# EAGLE design ArduProMini_chibi (EAGLE 6.2)
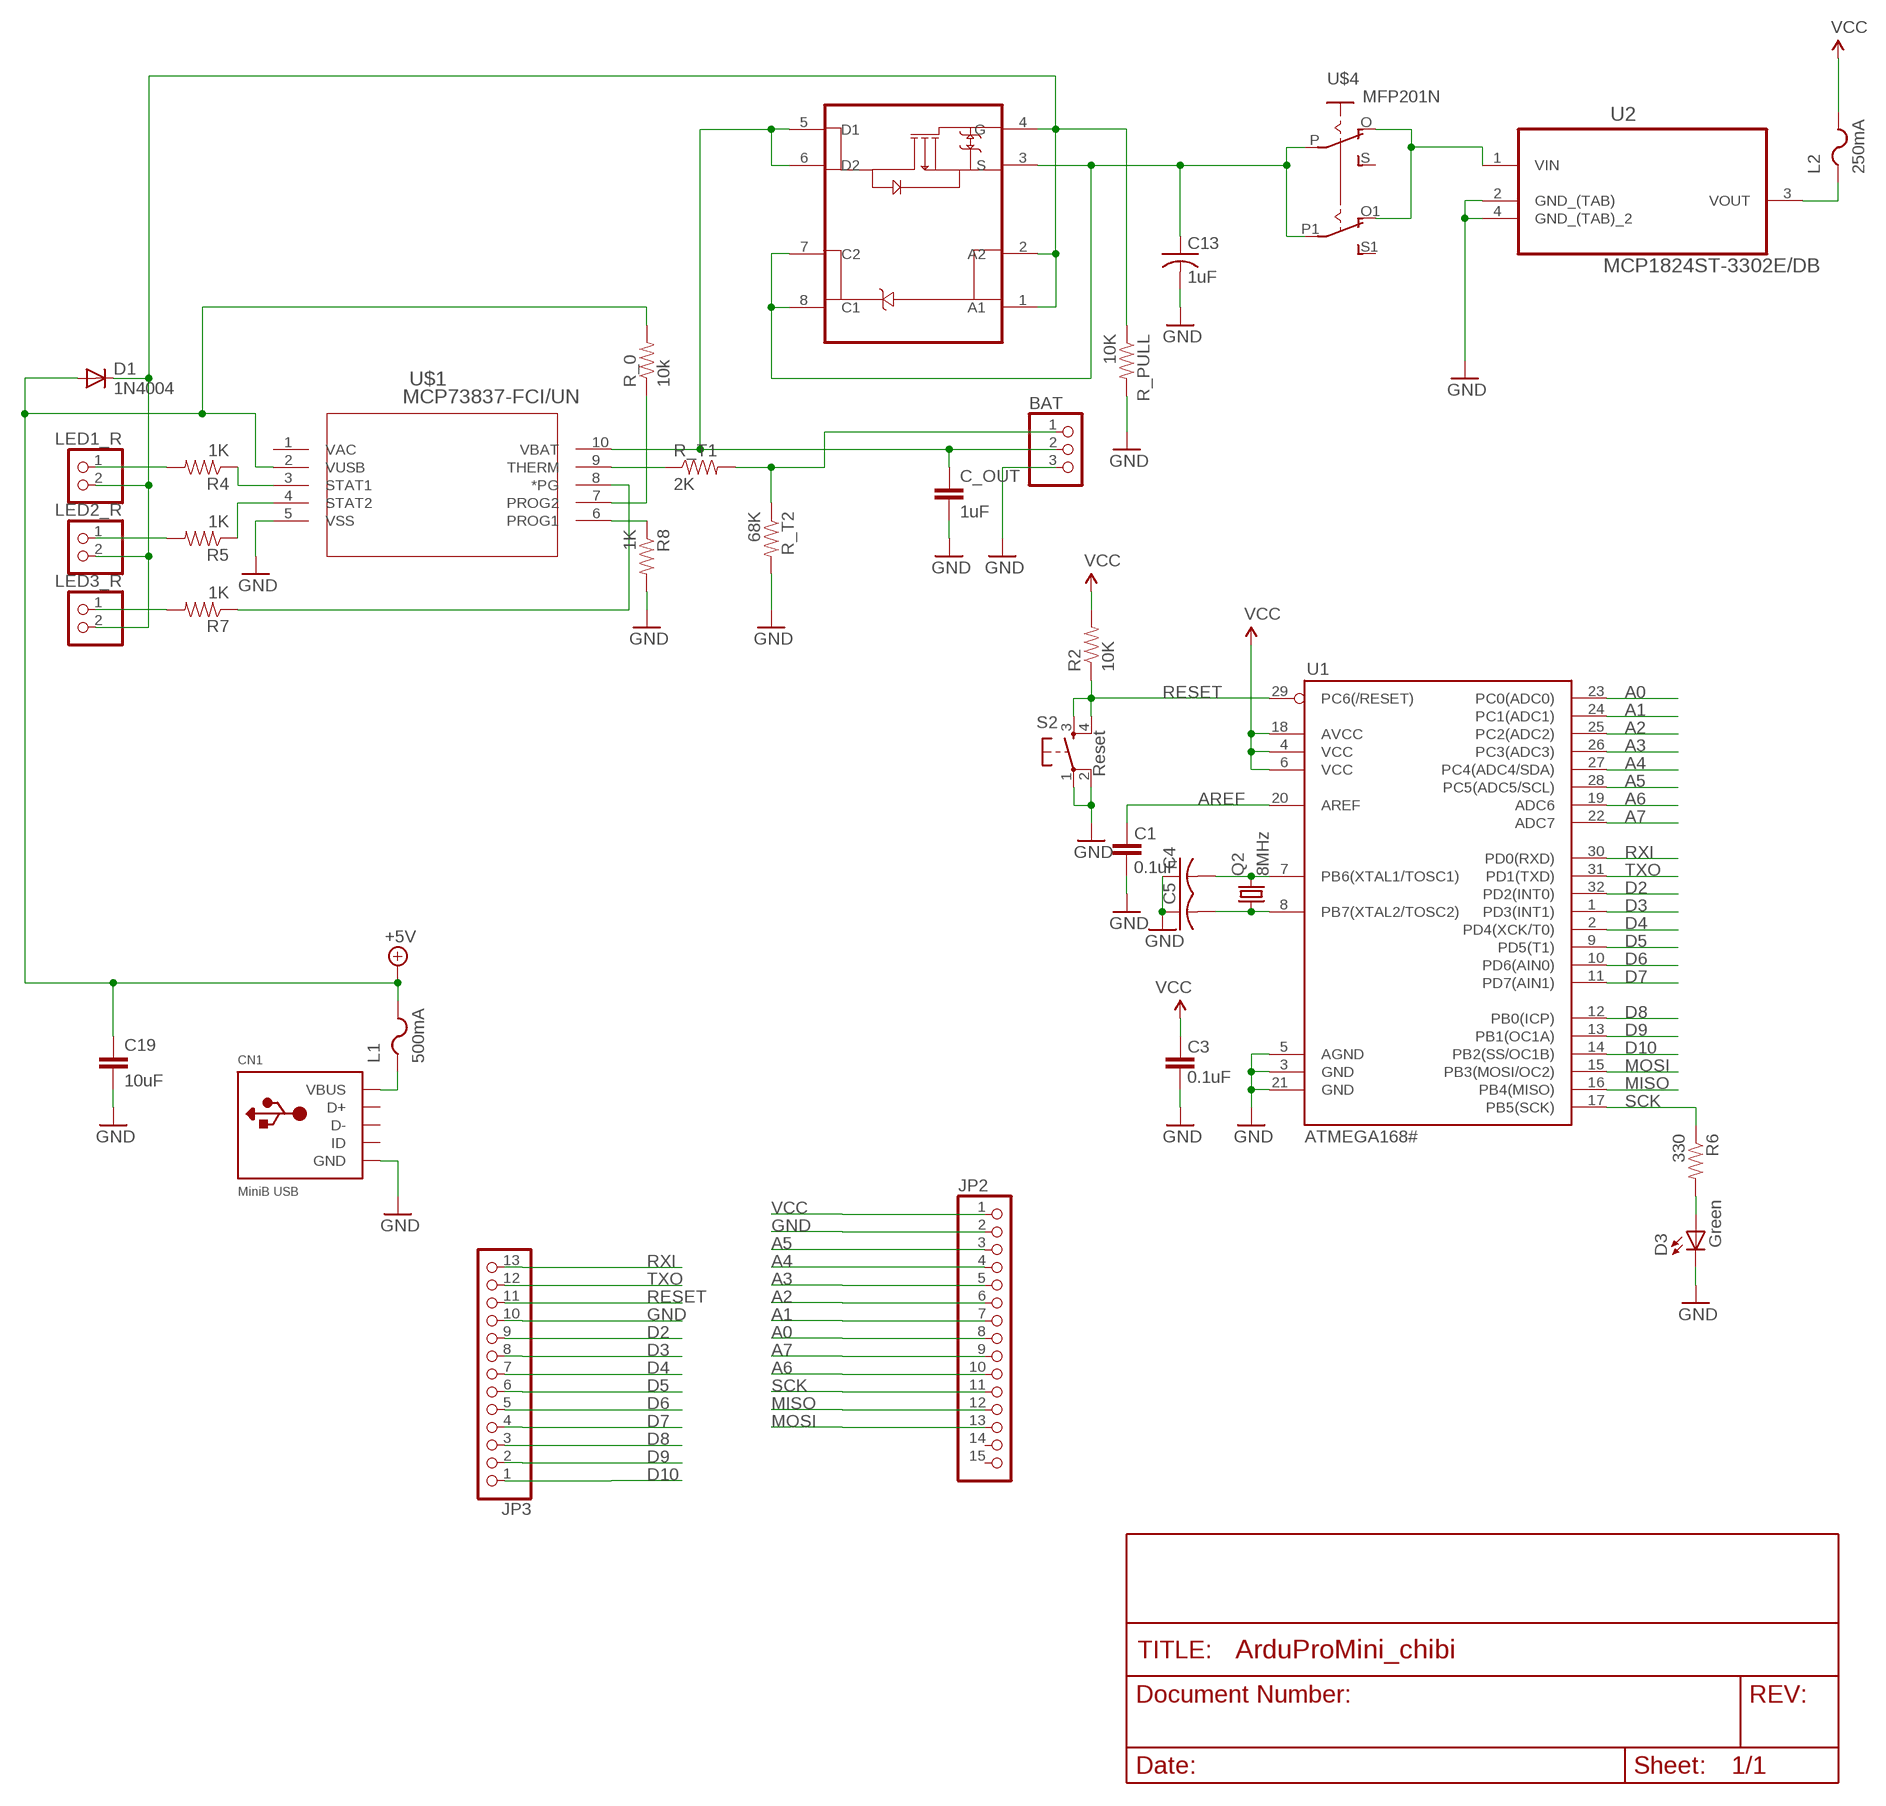
[diagram p0: schematic, sheet 1, part 1 of 2]
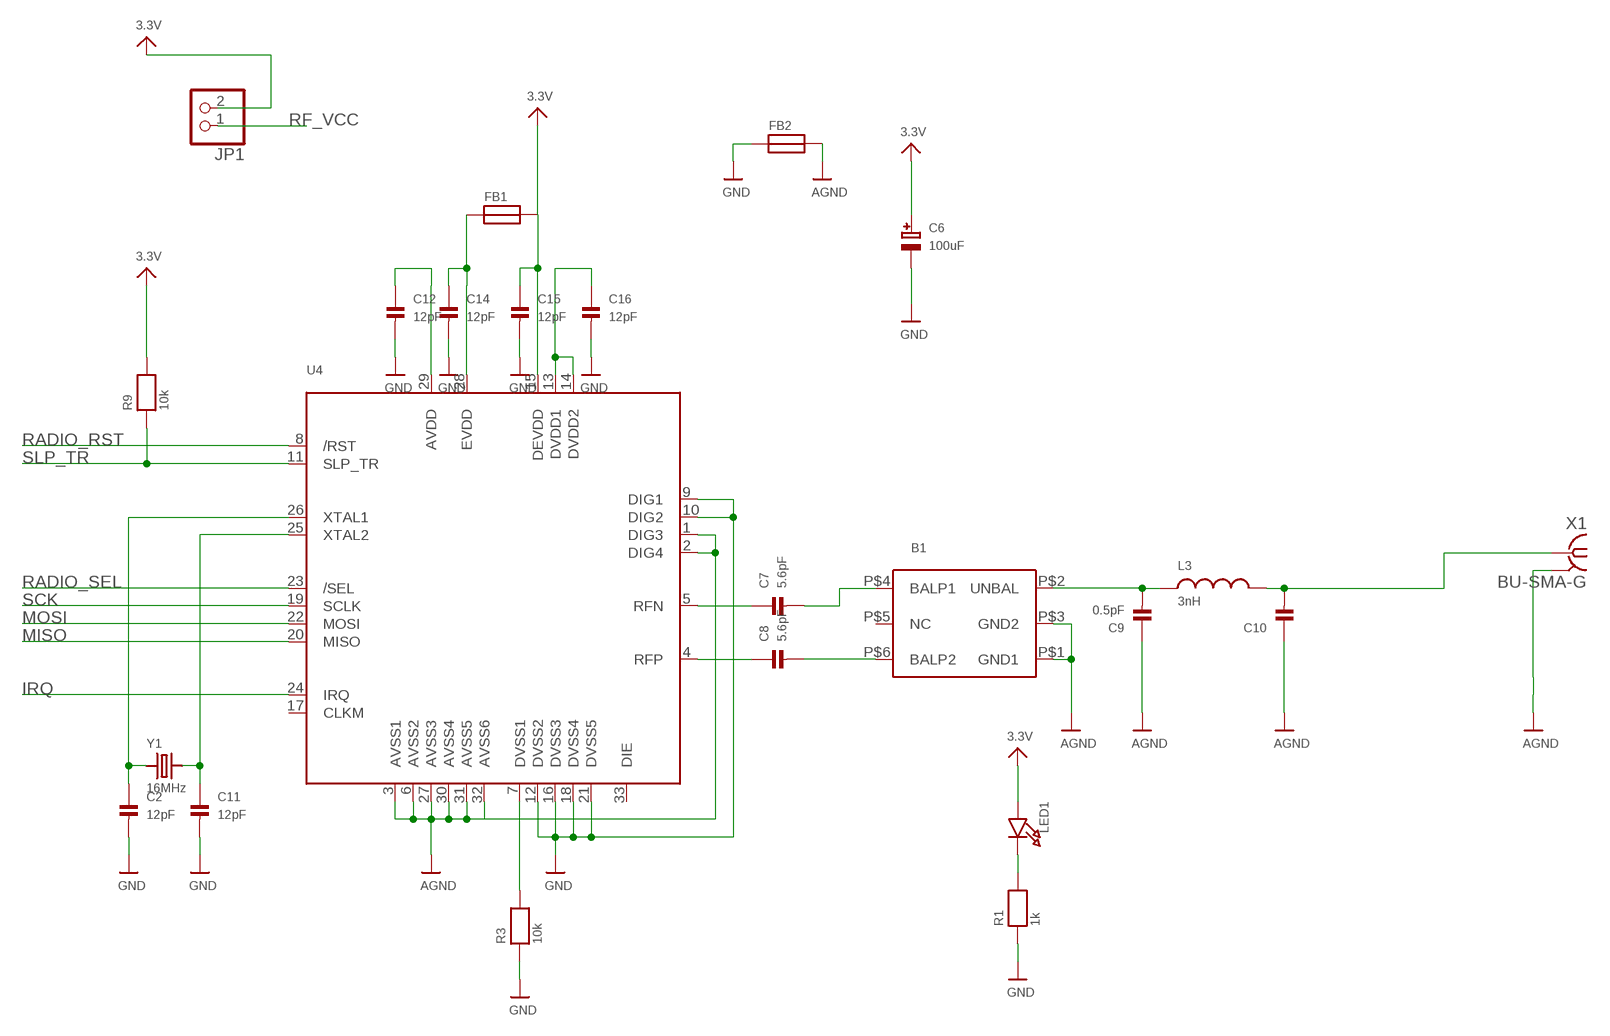
[diagram p1: schematic, sheet 1, part 2 of 2]

## Parts
B1  BALUN  [BALUN1206]
BAT  PINHD-1X3  [1X03]
C1  0.1uF  CAP0805  [0805]
C2  12pF  CAP_CERAMIC0805  [0805]
C3  0.1uF  CAP0805  [0805]
C4  C-USC0805  [C0805]
C5  C-USC0805  [C0805]
C6  100uF  CAP_ELECTROLYTICPANASONIC_C  [PANASONIC_C]
C7  5.6pF  CAP_CERAMIC0805  [0805]
C8  5.6pF  CAP_CERAMIC0805  [0805]
C9  0.5pF  CAP_CERAMIC0805  [0805]
C10  CAP_CERAMIC0805  [0805]
C11  12pF  CAP_CERAMIC0805  [0805]
C12  12pF  CAP_CERAMIC0805  [0805]
C13  1uF  C-USC0805  [C0805]
C14  12pF  CAP_CERAMIC0805  [0805]
C15  12pF  CAP_CERAMIC0805  [0805]
C16  12pF  CAP_CERAMIC0805  [0805]
C19  10uF  C-EUC1206  [C1206]
C_OUT  1uF  CAP0805  [0805]
CN1  MiniB USB  USBMINIB  [USB-MINIB]
D1  1N4004  [DO41-10]
D3  Green  LED0603  [LED-0603]
FB1  FERRITE  [0603]
FB2  FERRITE  [0603]
JP1  PINHD-1X2  [1X02]
JP2  PINHD-1X15  [1X15]
JP3  PINHD-1X13  [1X13]
L1  500mA  PTCFUSE-1206  [R1206]
L2  250mA  PTCFUSE-1206  [R1206]
L3  3nH  INDUCTOR0805  [0805]
LED1  LED0805  [CHIPLED_0805]
LED1_R  PINHD-1X2  [1X02]
LED2_R  PINHD-1X2  [1X02]
LED3_R  PINHD-1X2  [1X02]
Q2  8MHz  CRYSTALCTS406  [CTS406]
R1  1k  RESISTOR0805  [0805]
R2  10K  RESISTOR  [0805]
R3  10k  RESISTOR0805  [0805]
R4  1K  RESISTOR  [0805]
R5  1K  RESISTOR  [0805]
R6  330  RESISTOR  [0805]
R7  1K  RESISTOR  [0805]
R8  1K  RESISTOR  [0805]
R9  10k  RESISTOR0805  [0805]
R_0  10k  RESISTOR  [0805]
R_PULL  10K  RESISTOR  [0805]
R_T1  2K  RESISTOR  [0805]
R_T2  68K  RESISTOR  [0805]
S2  Reset  TAC_SWITCHSMD  [TACTILE_SWITCH_SMD]
U1  ATMEGA168#  ATMEGA168  [TQFP32-08]
U2  MCP1824ST-3302E/DB  [SOT230P700X180-4N]
U4  AT86RF212  [32QN2]
U$1  MCP73837-FCI/UN  [SOP50P490X110-8N]
U$3  FDFS2P753Z  [SOIC127P600X175-8N]
U$4  MFP201N  [MFP201N]
X1  BU-SMA-G  [BU-SMA-G]
Y1  16MHz  CRYSTALSMD  [HC49UP]

## Nets
+5V: C19.1 D1.A L1.2 R_0.2 U$1.2(VUSB)
A0: JP2.8 U1.23(PC0(ADC0))
A1: JP2.7 U1.24(PC1(ADC1))
A2: JP2.6 U1.25(PC2(ADC2))
A3: JP2.5 U1.26(PC3(ADC3))
A4: JP2.4 U1.27(PC4(ADC4/SDA))
A5: JP2.3 U1.28(PC5(ADC5/SCL))
A6: JP2.10 U1.19(ADC6)
A7: JP2.9 U1.22(ADC7)
AGND: B1.P$1(GND1) B1.P$3(GND2) C9.1 C10.1 FB2.2 U4.1(DIG3) U4.2(DIG4) U4.3(AVSS1) U4.6(AVSS2) U4.27(AVSS3) U4.30(AVSS4) U4.31(AVSS5) U4.32(AVSS6) X1.2(GND)
AREF: C1.2 U1.20(AREF)
D2: JP3.9 U1.32(PD2(INT0))
D3: JP3.8 U1.1(PD3(INT1))
D4: JP3.7 U1.2(PD4(XCK/T0))
D5: JP3.6 U1.9(PD5(T1))
D6: JP3.5 U1.10(PD6(AIN0))
D7: JP3.4 U1.11(PD7(AIN1))
D8: JP3.3 U1.12(PB0(ICP))
D9: JP3.2 U1.13(PB1(OC1A))
D10: JP3.1 U1.14(PB2(SS/OC1B))
GND: BAT.3 C1.1 C2.2 C3.1 C4.1 C5.1 C6.- C11.2 C12.2 C13.2 C14.2 C15.2 C16.2 C19.2 C_OUT.2 CN1.GND D3.C FB2.1 JP2.2 JP3.10 R1.1 R3.1 R8.2 R_PULL.2 R_T2.2 S2.1 S2.2 U1.3(GND) U1.5(AGND) U1.21(GND) U2.2(GND_(TAB)) U2.4(GND_(TAB)_2) U4.9(DIG1) U4.10(DIG2) U4.12(DVSS2) U4.16(DVSS3) U4.18(DVSS4) U4.21(DVSS5) U$1.5(VSS)
IRQ: U4.24(IRQ)
MISO: JP2.12 U1.16(PB4(MISO)) U4.20(MISO)
MOSI: JP2.13 U1.15(PB3(MOSI/OC2)) U4.22(MOSI)
N$1: C5.2 Q2.1 U1.8(PB7(XTAL2/TOSC2))
N$2: U2.1(VIN) U$4.O U$4.O1
N$3: C4.2 Q2.3 U1.7(PB6(XTAL1/TOSC1))
N$4: R_T1.1 U$1.9(THERM)
N$5: R7.1 U$1.8(*PG)
N$6: C13.1 U$3.3(S) U$3.7(C2) U$3.8(C1) U$4.P U$4.P1
N$7: D3.A R6.2
N$8: LED3_R.1 R7.2
N$9: BAT.2 C_OUT.1 U$1.10(VBAT) U$3.5(D1) U$3.6(D2)
N$10: L2.1 U2.3(VOUT)
N$11: D1.C LED1_R.2 LED2_R.2 LED3_R.2 R_PULL.1 U$3.1(A1) U$3.2(A2) U$3.4(G)
N$12: LED2_R.1 R5.2
N$13: LED1_R.1 R4.2
N$14: R5.1 U$1.4(STAT2)
N$15: R4.1 U$1.3(STAT1)
N$16: BAT.1 R_T1.2 R_T2.1
N$17: C7.1 U4.5(RFN)
N$18: R8.1 U$1.6(PROG1)
N$19: R_0.1 U$1.7(PROG2)
N$20: C8.1 U4.4(RFP)
N$21: B1.P$4(BALP1) C7.2
N$22: B1.P$6(BALP2) C8.2
N$23: B1.P$2(UNBAL) C9.2 L3.1
N$24: C10.2 L3.2 X1.1
N$25: LED1.C R1.2
N$26: C2.1 U4.26(XTAL1) Y1.1
N$27: C11.1 U4.25(XTAL2) Y1.2
N$28: R3.2 U4.7(DVSS1)
N$29: C16.1 U4.13(DVDD1) U4.14(DVDD2)
N$30: C14.1 FB1.1 U4.28(EVDD)
N$31: C12.1 U4.29(AVDD)
RADIO_RST: U4.8(/RST)
RADIO_SEL: U4.23(/SEL)
RESET: JP3.11 R2.1 S2.3 S2.4 U1.29(PC6(/RESET))
RF_VCC: C6.+ C15.1 FB1.2 JP1.1 LED1.A R9.2 U4.15(DEVDD) ; supply symbol labelled 3.3V
RXI: JP3.13 U1.30(PD0(RXD))
SCK: JP2.11 R6.1 U1.17(PB5(SCK)) U4.19(SCLK)
SLP_TR: R9.1 U4.11(SLP_TR)
TXO: JP3.12 U1.31(PD1(TXD))
VBUS: CN1.VBUS L1.1
VCC: C3.2 JP1.2 JP2.1 L2.2 R2.2 U1.4(VCC) U1.6(VCC) U1.18(AVCC) ; supply symbol labelled 3.3V
Unconnected: B1.P$5(NC) CN1.D+ CN1.D- CN1.ID JP2.14 JP2.15 U4.17(CLKM) U4.33(DIE) U$1.1(VAC) U$4.S U$4.S1

## Power pins joined to a net without a drawn wire
GND: X1.3(GND) X1.4(GND) X1.5(GND)

## Library data of the parts
B1 = microbuilder:BALUN: BALUN - Baluns for RF 1206 800-1000MHz Balun (1206) - Digikey: 712-1023-1-ND
BAT = pinhead:PINHD-1X3: PIN HEADER
C1 C3 C_OUT = SparkFun:CAP: Capacitor Standard 0603 ceramic capacitor, and 0.1" leaded capacitor.
C2 C7-C12 C14-C16 = microbuilder:CAP_CERAMIC: Ceramic Capacitors 0402 - 0402 Surface Mount Capacitors 16pF 50V 5% [Digikey: 445-4899-2-ND] 18pF 50V 5% [Digikey: 490-1281-2-ND] 22pF 50V 5% [Digikey: 490-1283-2-ND] 68pF 50V 5% [Digikey: 490-1289-2-ND] 0.1uF 10V 10% [Digikey: 490-1318-2-ND] 1.0uF 6.3V 10% [Digikey: 490-1320-2-ND] 0603 - 0603 Surface Mount Capacitors 16 pF 50V 5% [Digikey: 445-5051-2-ND] 22 pF 50V [Digikey: PCC220ACVTR-ND] 33 pF 50V 5% [Digikey: 490-1415-1-ND] 56pF 50V 5% [Digikey: 490-1421-1-ND] 220pF 50V 5% [Digikey: 445-1285-1-ND] 680 pF 50V 2200 pF 50V 5% C0G [Digikey: 445-1297-1-ND] 5600 pF 100V 5% X7R [Digikey: 478-3711-1-ND] 0.1 µF 25V 10% [Digikey: PCC2277TR-ND] 0.22 µF 16V 10% X7R [Digikey: 445-1318-1-ND] 1.0 µF 25V 10% [Digikey: 445-5146-2-ND] 0603 - RF Specific 3pF 250V +/-0.1pF RF [Digikey: 712-1347-1-ND] 18 pF 250V 5% [Digikey: 478-3505-1-ND or 712-1322-1-ND] 56 pF 250V 5% C0G RF [Digikey: 490-4867-1-ND] 68 pF 250V RF [Digikey: 490-4868-1-ND] 0805 - 0805 Surface Mount Capacitors 220 pF 250V 2% RF Ceramic Capacitor [Digikey: 712-1398-1-ND] 1000 pF 50V 2% NP0 Ceramic Capacitor [Digikey: 478-3760-1-ND] 0.1 µF 25V 10% Ceramic Capacitor [Digikey: PCC1828TR-ND] 1.0 µF 16V 10% Ceramic Capacitor[Digikey: 490-1691-2-ND] 10.0 µF 10V 10% Ceramic Capacitor[Digikey: 709-1228-1-ND] 10.0 uF 16V 10% Ceramic Capacitor [Digikey: 478-5165-2-ND] 47 uF 6.3V 20% Ceramic Capacitor [Digikey: 587-1779-1-ND or 399-5506-1-ND] 1206 - 1206 Surface Mount Capacitors 47uF 10V 20% Ceramic Capacitor [Digikey: 490-5528-1-ND or 399-5508-1-ND or 445-6010-1-ND]
C4 C5 C13 = rcl:C-US: CAPACITOR, American symbol
C6 = microbuilder:CAP_ELECTROLYTIC: Electrolytic Capacitors PANASONIC_C - Size C Panasonic Electrolytic Aluminum Capacitor 47µF 16V 20% Electrolytic Capacitor [Digikey: PCE3890TR-ND] PANASONIC_D - Size D Panasonic Electrolytic Aluminum Capacitor 100µF 25V 20% Electrolytic Capacitor [Digikey: PCE3898TR-ND]
C19 = rcl:C-EU: CAPACITOR, European symbol
CN1 = adafruit:USB: USB Connectors USBMINIB - Surface Mount Female Mini-B USB Connector 4UConnector: 06564 By microbuilder.eu Thru-hole RA Female Mini-B USB Connector 4UConnector: 18732 By ladyada.net
D1 = diode:1N4004: DIODE general purpose rectifier, 1 A
D3 = SparkFun:LED: LEDs Standard schematic elements and footprints for 5mm, 3mm, 1206, and 0603 sized LEDs. 5mm - Spark Fun Electronics SKU : COM-00529 (and others)
FB1 FB2 = microbuilder:FERRITE: Ferrite Bead 0603 MMZ1608B121C - 120 Ohm, 600mA Ferrite Chip - Digikey: 445-2164-1-ND BK1608HW121-T - 120 Ohm, 600mA Ferrite Chip - Digikey: 587-1876-2-ND
JP1 LED1_R LED2_R LED3_R = pinhead:PINHD-1X2: PIN HEADER
JP2 = pinhead:PINHD-1X15: PIN HEADER
JP3 = pinhead:PINHD-1X13: PIN HEADER
L1 L2 = adafruit:PTCFUSE: PTC fuses, resettable thermistors
L3 = microbuilder:INDUCTOR: Inductors 0603: 10nH Ceramic Inductor - microwire antenna/RF (Digikey: 712-1434-2-ND) 0805: 560nH Ceramic Inductor - RF (Digikey: 553-1047-1-ND) 1007 (2518 Metric) SMT: 10µH 10% 250mOhm 820mA 1007 Inductor (Digikey: 587-2189-1-ND) 22µH 10% 500mOhm 580mA 1007 Inductor (Digikey: 587-2190-1-ND) 47µH 10% 950mOhm 420mA 1007 Inductor (Digikey: 587-2191-1-ND) 47µH 5% 100mOhm 1A 1008 Inductor (Digikey: 732-1816-1-ND) 6.0x6.0mm: 4.7µH 20% 3.8A 27mOhm Inductor (Digikey: 445-6538-2-ND)
LED1 = microbuilder:LED: LED 0603 - 0603 Surface Mount Package 2mA: Green LED - Low Power (3.9mcd, 2ma, 1.7Vf) - Digikey: 475-2709-2-ND Orange LED - Low Power (9.8mcd, 2ma, 1.8Vf) - Digikey: 475-1194-2-ND Red LED - Low Power (5mcd, 2ma, 1.8Vf) - Digikey: 475-1195-2-ND Yellow LED - Low Power (7mcd, 2ma, 1.8Vf) - Digikey: 475-1196-2-ND 5mA: Blue LED - Low Power (17mcd, 5ma, 2.9Vf) - Digikey: LNJ937W8CRACT-ND 0805 - 0805 Surface Mount Package 2mA: Red LED (8.8mcd, 2mA, 1.8Vf, Clear) - Low Power [Digikey: 475-2510-1-ND] Green LED (5mcd, 2mA, 1.8Vf, Clear) - Low Power [Digikey: 475-2730-1-ND] Yellow LED (11.3mcd, 2mA, 1.8Vf, Clear) - Low Power [Digikey: 475-2555-1-ND] 20mA: Red LED (104mcd, 20mA, Diffused) - LS R976 [Digikey: 475-1278-6-ND] Red LED (12mcd, 20mA, 2.0Vf, Clear) - APT2012EC [Digikey: 754-1128-1-ND] Green LED (15mcd, 20mA, 2.2Vf, Clear) - APT2012GC [Digikey: 754-1131-1-ND] Orange LED (160mcd, 20mA, 2.1Vf, Clear) - APT2012SECK [Digikey: 754-1130-1-ND] 1206 - 1206 Surface Mount Package Green LED (26mcd, 20mA, Diffused) - LG N971 [Digikey: 475-1407-6-ND] Red LED (15mcd, 20mA, Diffused) - LH N974 [Digikey: 475-1416-6-ND]
Q2 = crystal:CRYSTAL: CRYSTAL; OC_FARNELL: unknown; OC_NEWARK: unknown
R1 R3 R9 = microbuilder:RESISTOR: Resistors 0402 - 0402 Surface Mount Package 22 Ohm 1% 1/16W [Digikey: 311-22.0LRTR-ND] 33 Ohm 5% 1/16W 1.0K 5% 1/16W 1.5K 5% 1/16W 2.0K 1% 1/16W 10.0K 1% 1/16W [Digikey: 311-10.0KLRTR-ND] 10.0K 5% 1/16W [Digikey: RMCF0402JT10K0TR-ND] 12.1K 1% 1/16W [Digikey: 311-22.0LRTR-ND] 100.0K 5% 1/16W 0603 - 0603 Surface Mount Package 0 Ohm 1/10 Watt 1% Resistor 15 Ohm 1/10 Watt 1% Resistor 33 Ohm 1/10 Watt 1% Resistor 49.9 Ohm 1/10 Watt 1% Resistor 100 Ohm 1/10 Watt 1% Resistor 150 Ohm 1/10 Watt 1% Resistor 240 Ohm 1/10 Watt 1% Resistor 390 Ohm 1/10 Watt 1% Resistor 560 Ohm 1/10 Watt 1% Resistor 680 Ohm 1/10 Watt 1% Resistor 750 Ohm 1/10 Watt 1% Resistor 1.0K Ohm 1/10 Watt 1% Resistor 1.5K Ohm 1/10 Watt 1% Resistor 2.0K Ohm 1/10 Watt 1% Resistor 2.2K Ohm 1/10 Watt 1% Resistor 3.3K Ohm 1/10 Watt 1% Resistor 4.7K Ohm 1/10 Watt 1% Resistor 10.0K Ohm 1/10 Watt 1% Resistor 12.0K Ohm 1/10 Watt 1% Resistor 12.1K Ohm 1/10 Watt 1% Resistor 20.0K Ohm 1/10 Watt 1% Resistor 33.0K Ohm 1/10 Watt 1% Resistor 100.0K Ohm 1/10 Watt 1% Resistor 0805 - 0805 Surface Mount Package 0 Ohm 1/8 Watt 1% Resistor 33 Ohm 1/8 Watt 1% Resistor 100 Ohm 1/8 Watt 1% Resistor 150 Ohm 1/8 Watt 1% Resistor 200 Ohm 1/8 Watt 1% Resistor 240 Ohm 1/8 Watt 1% Resistor 330 Ohm 1/8 Watt 1% Resistor 390 Ohm 1/8 Watt 1% Resistor 470 Ohm 1/8 Watt 1% Resistor 1.0K Ohm 1/8 Watt 1% Resistor 1.5K Ohm 1/8 Watt 1% Resistor 2.0K Ohm 1/8 Watt 1% Resistor 4.7K Ohm 1/8 Watt 1% Resistor 5.1K Ohm 1/8 Watt 1% Resistor 5.6K Ohm 1/8 Watt 1% Resistor 10.0K Ohm 1/8 Watt 1% Resistor 22.0K Ohm 1/8 Watt 1% Resistor 33.0K Ohm 1/8 Watt 1% Resistor 100K Ohm 1/8 Watt 1% Resistor 1206 - 1206 Surface Mount Package 2012 - 2010 Surface Mount Package 0.11 Ohm 1/2 Watt 1% Resistor - Digikey: RHM.11UCT-ND
R2 R4-R8 R_0 R_PULL R_T1 R_T2 = SparkFun:RESISTOR: Resistor Basic schematic elements and footprints for 0603, 1206, and PTH 1/10th watt (small) resistors.
S2 = SparkFun:TAC_SWITCH: Momentary Switch Button commonly used for reset or general input. Spark Fun Electronics SKU : COM-00097
U1 = SparkFun:ATMEGA168
U2 = Microchip-MCP1824ST-3302E_DB:MCP1824ST-3302E/DB: IC, LDO VOLT REG, 3.3V, 0.3A,; MPN: MCP1824ST-3302E/DB; OC_FARNELL: 1578379; OC_NEWARK: 05N1293; PACKAGE: SOT-223-3; SUPPLIER: Microchip
U4 = microbuilder:AT86RF212: AT86RF212 - Low-Power SPI-based 700/800/900 MHz Transceiver Digikey: AT86RF212-ZU-ND
U$1 = Microchip-MCP73837-FCI_UN:MCP73837-FCI/UN: Battery Charger; DESCRIPTION: BATTERY CHARGER; MPN: MCP73837-FCI/UN; OC_FARNELL: 1675426; OC_NEWARK: 77M3068; PACKAGE: MSOP-8; SUPPLIER: Microchip
U$3 = FDFS2P753Z:FDFS2P753Z: MOSFET, P, SCHOTTKY, SMD
U$4 = SPDT switch:MFP201N
X1 = con-coax:BU-SMA-G: FEMALE SMA CONNECTOR Radiall distributor RS 193-9117; OC_FARNELL: unknown; OC_NEWARK: unknown
Y1 = microbuilder:CRYSTAL: Crystals HC49UP - Surface Mount Crystal 4.0MHz 18pF +/-30ppm Surface Mount Crystal [Digikey: 535-9857-1-ND] 12.0 MHz Surface Mount Crystal [Digikey: 535-9869-6-ND] 25.0 MHz Surface Mount Crystal [Digikey: 535-9078-1-ND] 3.2 x 2.5mm - MEMs SMT Crystal 12.0 MHz 8pF 15ppm 3.2 x 2.5mm Crystal [Digikey: -10-70°C: 644-1047-1-ND -40-125°C: 644-1128-1-ND] 16.0 MHz 8pF 15ppm 3.2 x 2.5mm Crystal [Digikey: -10-70°C: 644-1049-1-ND -40-125°C: 644-1129-2-ND] 16.0 MHz 10pF 10ppm 3.2 x 2.5mm Crystal [Digikey: 644-1100-1-ND] 27.12 MHz 18pF 30ppm 3.2 x 2.5mm Crystal [Digikey: 887-1424-1-ND] 27.12MHz 10pF 10ppm 3.2 x 2.5mm Crystal [Digikey: 887-1329-1-ND] 4.9 x 1.8mm - MEMs SMT Crystal 32.768 KHz 12.5pF 20ppm 4.9 x 1.8mm Crystal [Digikey: SE2415CT-ND] Cylinder 32.768KHz Cylinder Crystal

## Net classes
1 vcc: width 0.254 mm

## Board
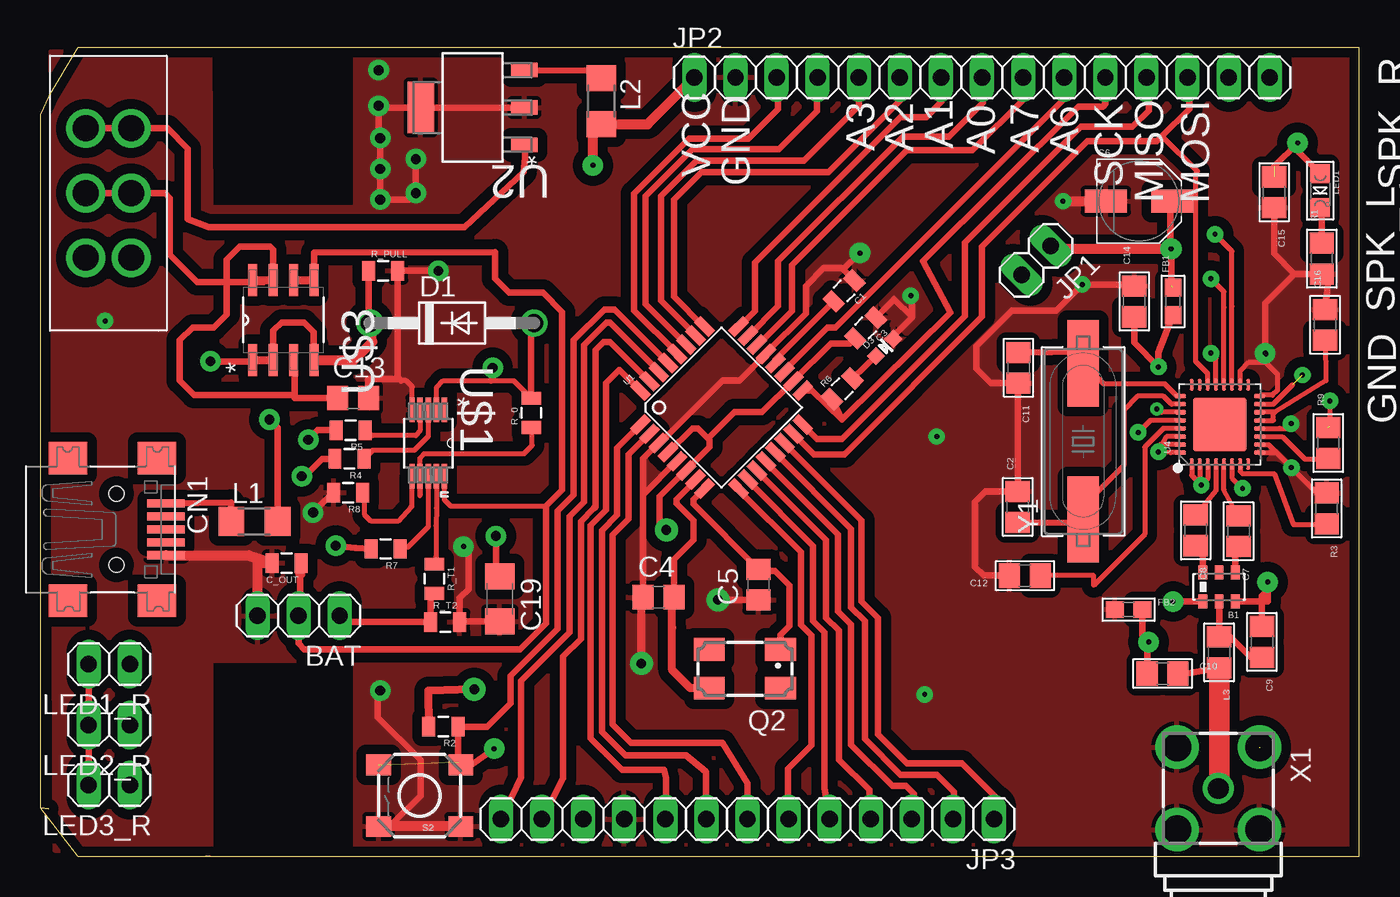
[diagram p2: board, top side]
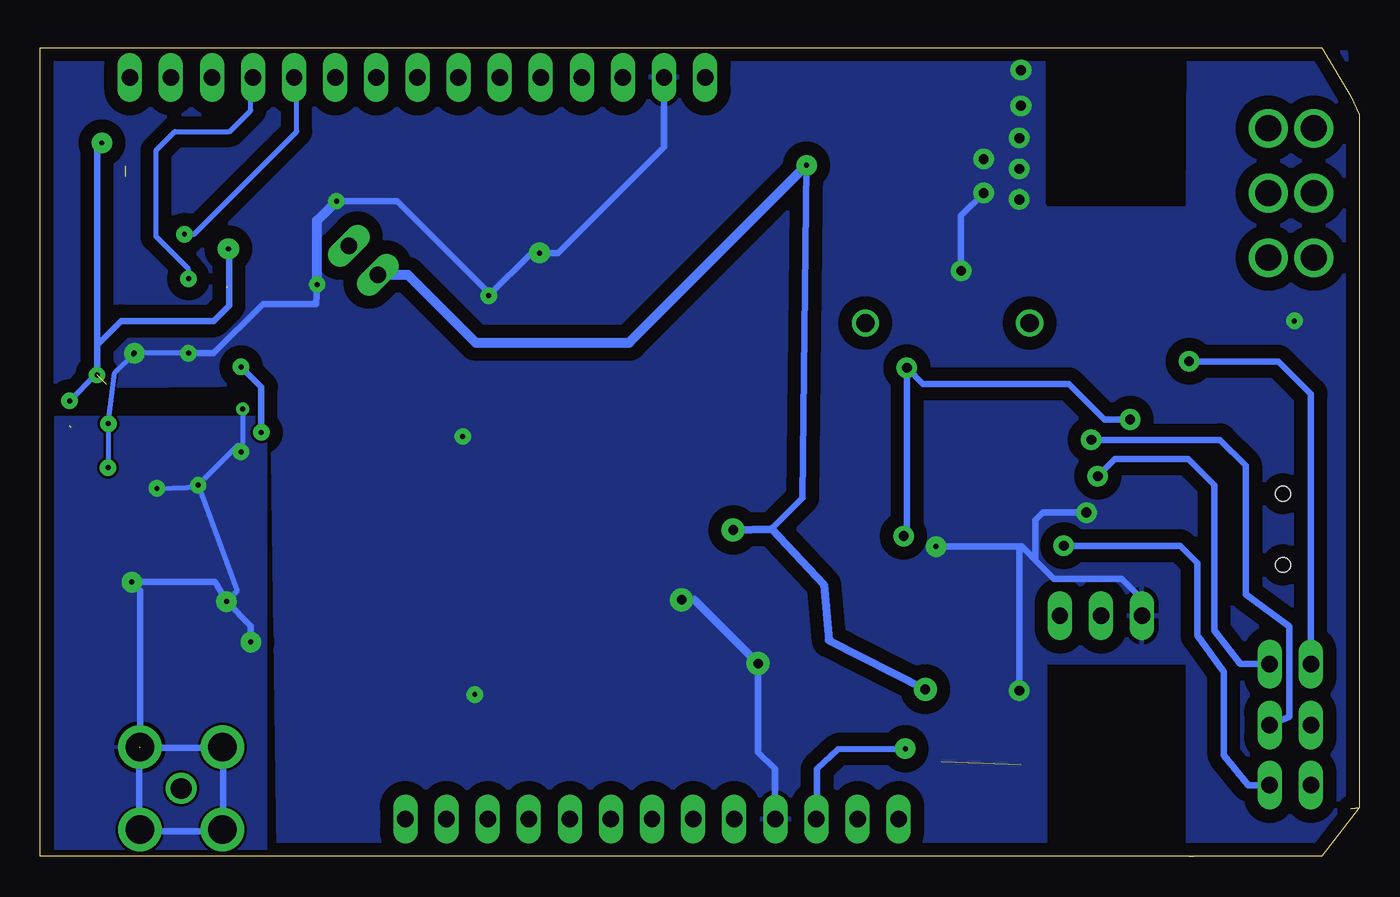
[diagram p3: board, bottom side, seen from below]

Size 81.5 x 50 mm. Coordinates in mm from the lower left corner, seen from the top.
Outline: 0,3 0,45.85 0.5,47 2.3,50 10.5,50 19.5,50 81.5,50 81.5,0 19.5,0 19.2,0 10.2,0
Outline: 0,3 0.5,2.95 0,3
Outline: 0,3 2.3,0 10.2,0
Outline: 10.2,0 10.5,0 10.2,0
Copper layers (1*16): Top 0.035mm / dielectric 1.5mm / Bottom 0.035mm
Design rules: minimum track width 6mil, minimum drill 12mil, track to track 6mil, track to pad 6mil, pad to pad 6mil, via to via 6mil, smd to smd 0mil, copper to edge 10mil, drill to drill 10mil, minimum pad ring 10mil, minimum via ring 6mil, stop-mask expansion 2mil, vias tented up to drill 100mil, thermal gap 10mil

### Footprints (pad centres in the part's own frame; a part is rotated, then mirrored left to right if it is on the bottom)
BALUN1206 = smd 0.55 x 0.85: P$1 1,0.9; P$2 0,0.9; P$3 -1,0.9; P$4 -1,-0.9; P$5 0,-0.9; P$6 1,-0.9
1X03 = drill 1.016 long: 1 -2.54,0; 2 0,0; 3 2.54,0
0805 = smd 0.8 x 1.2: 1 -0.9,0; 2 0.9,0
0805' = smd 1.3 x 1.5: 1 -0.95,0; 2 0.95,0
C0805 = smd 1.3 x 1.5: 1 -0.95,0; 2 0.95,0
PANASONIC_C = smd 2.6 x 1.4: + 2.05,0; - -2.05,0
C1206 = smd 1.6 x 1.8: 1 -1.4,0; 2 1.4,0
USB-MINIB = smd 0.5 x 2.308: D+ 0,4.064; D- -0.8,4.064; GND 1.6,4.064; ID 0.8,4.064; VBUS -1.6,4.064 | smd 2 x 2.4: GND1 -4.4,-2; GND2 -4.4,3.5; GND3 4.4,3.5; GND4 4.4,-2 | hole 0.9: -2.2,1; 2.2,1
DO41-10 = drill 1.118: A 5.08,0; C -5.08,0
LED-0603 = smd 0.8 x 0.8: A 0,-0.75; C 0,0.75
0603 = smd 1.1 x 1: 1 -0.85,0; 2 0.85,0
1X02 = drill 1.016 long: 1 -1.27,0; 2 1.27,0
1X15 = drill 1.016 long: 1 -17.78,0; 2 -15.24,0; 3 -12.7,0; 4 -10.16,0; 5 -7.62,0; 6 -5.08,0; 7 -2.54,0; 8 0,0; 9 2.54,0; 10 5.08,0; 11 7.62,0; 12 10.16,0; 13 12.7,0; 14 15.24,0; 15 17.78,0
1X13 = drill 1.016 long: 1 -15.24,0; 2 -12.7,0; 3 -10.16,0; 4 -7.62,0; 5 -5.08,0; 6 -2.54,0; 7 0,0; 8 2.54,0; 9 5.08,0; 10 7.62,0; 11 10.16,0; 12 12.7,0; 13 15.24,0
R1206 = smd 1.6 x 1.803: 1 -1.422,0; 2 1.422,0
CHIPLED_0805 = smd 1.2 x 1.2: A 0,-1.05; C 0,1.05
CTS406 = smd 1.9 x 1.4: 1 -2.2,-1.2; 2 2.2,-1.2; 3 2.2,1.2; 4 -2.2,1.2
TACTILE_SWITCH_SMD = smd 1.524 x 1.27: 1 -2.54,1.905; 2 2.54,1.905; 3 -2.54,-1.905; 4 2.54,-1.905
TQFP32-08 = smd 1.27 x 0.559: 1 -4.293,2.8; 2 -4.293,2; 3 -4.293,1.2; 4 -4.293,0.4; 5 -4.293,-0.4; 6 -4.293,-1.2; 7 -4.293,-2; 8 -4.293,-2.8; 17 4.293,-2.8; 18 4.293,-2; 19 4.293,-1.2; 20 4.293,-0.4; 21 4.293,0.4; 22 4.293,1.2; 23 4.293,2; 24 4.293,2.8 | smd 0.559 x 1.27: 9 -2.8,-4.293; 10 -2,-4.293; 11 -1.2,-4.293; 12 -0.4,-4.293; 13 0.4,-4.293; 14 1.2,-4.293; 15 2,-4.293; 16 2.8,-4.293; 25 2.8,4.293; 26 2,4.293; 27 1.2,4.293; 28 0.4,4.293; 29 -0.4,4.293; 30 -1.2,4.293; 31 -2,4.293; 32 -2.8,4.293
SOT230P700X180-4N = smd 1.626 x 0.889: 1 -3.2,2.311; 2 -3.2,0; 3 -3.2,-2.311 | smd 1.626 x 3.175: 4 3.2,0
32QN2 = smd 0.7 x 0.25: 1 -2.45,1.75; 2 -2.45,1.25; 3 -2.45,0.75; 4 -2.45,0.25; 5 -2.45,-0.25; 6 -2.45,-0.75; 7 -2.45,-1.25; 8 -2.45,-1.75; 17 2.45,-1.75; 18 2.45,-1.25; 19 2.45,-0.75; 20 2.45,-0.25; 21 2.45,0.25; 22 2.45,0.75; 23 2.45,1.25; 24 2.45,1.75 | smd 0.25 x 0.7: 9 -1.75,-2.45; 10 -1.25,-2.45; 11 -0.75,-2.45; 12 -0.25,-2.45; 13 0.25,-2.45; 14 0.75,-2.45; 15 1.25,-2.45; 16 1.75,-2.45; 25 1.75,2.45; 26 1.25,2.45; 27 0.75,2.45; 28 0.25,2.45; 29 -0.25,2.45; 30 -0.75,2.45; 31 -1.25,2.45; 32 -1.75,2.45 | smd 3.3 x 3.3: 33 0,0
SOP50P490X110-8N = smd 1.499 x 0.33: 1 -2.057,0.991; 2 -2.057,0.508; 3 -2.057,0; 4 -2.057,-0.508; 5 -2.057,-0.991; 6 2.057,-0.991; 7 2.057,-0.508; 8 2.057,0; 9 2.057,0.508; 10 2.057,0.991
SOIC127P600X175-8N = smd 1.981 x 0.559: 1 -2.464,1.905; 2 -2.464,0.635; 3 -2.464,-0.635; 4 -2.464,-1.905; 5 2.464,-1.905; 6 2.464,-0.635; 7 2.464,0.635; 8 2.464,1.905
MFP201N = drill 1.6: O -4,-1.4; O1 -4,1.4; P 0,-1.4; P1 0,1.4; S 4,-1.4; S1 4,1.4
BU-SMA-G = drill 1.27: 1 0,0 | drill 1.778: 2 -2.55,2.55; 3 2.55,2.55; 4 2.55,-2.55; 5 -2.55,-2.55
HC49UP = smd 5.334 x 1.93: 1 -4.826,0; 2 4.826,0

### Placement (x,y rotation side)
B1  72.85,16.65 180 top
BAT  15.95,14.87 180 top
C1  49.67,34.95 225 top
C2  12pF  [0805']  60.4,21.6 90 top
C3  51,32.66 225 top
C4  38.2,16.01 0 top
C5  44.38,16.79 90 top
C6  67.9,40.5 0 top
C7  5.6pF  [0805']  74.05,20.1 270 top
C8  5.6pF  [0805']  71.4,20.15 270 top
C9  0.5pF  [0805']  75.5,13.25 270 top
C10  [0805']  69.35,11.3 0 top
C11  12pF  [0805']  60.45,30.2 270 top
C12  12pF  [0805']  60.85,17.35 180 top
C13  19.33,28.33 0 top
C14  12pF  [0805']  67.6,34.3 90 top
C15  12pF  [0805']  76.25,41.05 270 top
C16  12pF  [0805']  79.4,32.85 90 top
C19  28.39,15.91 270 top
C_OUT  15.22,18.12 180 top
CN1  3.7,20.21 270 top
D1  25.44,32.97 0 top
D3  52.18,31.46 315 top
FB1  70,34.3 90 top
FB2  67.25,15.25 0 top
JP1  61.55,36.85 225 top
JP2  58.2,48.15 0 top
JP3  43.7,2.3 180 top
L1  13.23,20.69 0 top
L2  34.67,46.68 270 top
L3  3nH  [0805']  72.85,12.6 270 top
LED1  79.1,41.15 180 top
LED1_R  4.25,11.88 180 top
LED2_R  4.25,8.12 180 top
LED3_R  4.25,4.4 180 top
Q2  43.54,11.59 180 top
R1  1k  [0805']  79.2,36.95 90 top
R2  24.9,8.03 180 top
R3  10k  [0805']  79.5,21.5 270 top
R4  19.1,24.58 180 top
R5  19.17,26.34 180 top
R6  49.55,28.91 45 top
R7  21.34,19 180 top
R8  19.02,22.49 180 top
R9  10k  [0805']  79.6,25.55 90 top
R_0  30.33,27.41 90 top
R_PULL  21.18,36.2 0 top
R_T1  24.35,17.16 270 top
R_T2  25.02,14.48 0 top
S2  23.44,3.75 180 top
U1  42.1,27.74 45 top
U2  26.71,46.29 180 top
U4  72.9,26.7 90 top
U$1  23.96,25.55 270 top
U$3  15.02,33.15 90 top
U$4  4.2,41 270 top
X1  72.8,4.2 270 top
Y1  64.45,25.65 90 top

### Tracks (layer width: path | path; a pad name or v marks a point on that pad's centre or on a via)
+5V  (via drill 0.6 pad 1.27)
  Top 0.305: U$1.2 24.47,28.97 24.9,29.4 27.85,29.4 29.25,29.4 R_0.2
  Top 0.406: R_0.2 30.33,32.67 D1.A | L1.2 14.65,26.5 v14.15,27 | v27.95,30.2 27.95,29.5 27.85,29.4 | v28.15,19.8 28.15,17.55 C19.1
  Bottom 0.406: v14.15,27 15.75,27 17.95,29.2 26.95,29.2 v27.95,30.2 27.95,20 v28.15,19.8
A0
  Top 0.406: U1.23 43.79,32.19 45.6,34 45.6,36.8 53.3,44.5 56.15,44.5 58.25,46.6 58.25,48.1 JP2.8
A1
  Top 0.406: U1.24 43.21,32.76 44.15,33.7 44.15,36.7 53.15,45.7 54.75,45.7 55.7,46.65 55.7,48.11 JP2.7
A2
  Top 0.406: U1.25 40.99,32.76 39.15,34.6 39.15,40.6 40.85,42.3 48.7,42.3 53.15,46.75 53.15,48.12 JP2.6
A3
  Top 0.406: U1.26 40.48,32.22 38.35,34.35 38.35,40.8 40.55,43 47.2,43 50.6,46.4 50.6,48.13 JP2.5
A4
  Top 0.406: U1.27 37.4,34.15 37.4,40.8 40.3,43.7 45.65,43.7 48,46.05 48,48.11 JP2.4
A5
  Top 0.406: U1.28 39.35,31.1 36.7,33.75 36.7,40.95 40.1,44.35 43.75,44.35 45.6,46.2 45.6,48.05 JP2.3
A6
  Top 0.406: U1.19 45.98,30.03 48.65,32.7 49.15,32.7 63.3,46.85 63.3,48.13 JP2.10
A7
  Top 0.406: U1.22 44.38,31.63 46.45,33.7 46.45,36.55 53.55,43.65 57.6,43.65 60.8,46.85 60.8,48.09 JP2.9
AGND  (via drill 0.3 pad 0.81, 0.3 pad 1.02, 0.3 pad 1.27)  (1 unrouted)
  Top 0.305: U4.6 73.65,23.4 v74.3,22.75 | U4.3 72.15,23.35 v71.75,22.95 | U4.2 71.65,23.05 v71.75,22.95 | U4.1 71.15,23.55 v71.75,22.95 | U4.32 69.85,24.95 v69.1,25 | U4.31 69.2,25.45 v69.1,25 | U4.30 69.6,25.95 v69.1,25 | U4.27 69.3,27.45 v69,27.65
  Top 0.406: v70,15.75 B1.P$1 | B1.P$3 75,15.75 75.85,15.75 75.85,16.45 | 75.85,16.45 v75.85,16.95 | C10.1 68.4,13.15 v68.5,13.25 68.1,13.65 FB2.2 | C9.1 75.5,16.1 75.85,16.45
  Bottom 0.305: v71.75,22.95 69.35,16.4 v70,15.75 | v74.3,22.75 72.45,22.8 v71.75,22.95 | v71.75,22.95 69.3,25.4 v69.1,25 69,25.65 v69,27.65
  Bottom 0.406: X1.2 75.35,16.45 v75.85,16.95 70.7,16.95 v70,15.75 68.5,14.25 v68.5,13.25 | 75.5,1.55 75.4,1.55 | 75.4,1.55 70.2,1.55 70.2,6.7 75.4,6.7 75.4,6.75 75.4,1.55
  pour Bottom: 67.55,27.15 80.6,27.15 80.6,0.45 67.55,0.45
AREF
  Top 0.406: U1.20 45.42,30.7 C1.2
D2
  Top 0.406: U1.32 37.05,28.8 35.8,30.05 35.75,30.05 34.95,29.25 34.95,21.4 34,20.45 34,7.3 35.95,5.35 38.55,5.35 38.65,4.85 38.65,3.31 JP3.9
D3
  Top 0.406: JP3.8 41.13,5.22 39.9,6.25 36.15,6.25 34.7,7.7 34.7,20.15 35.65,21.1 35.65,25.25 U1.1
D4
  Top 0.406: U1.2 37.62,26.12 36.35,24.85 36.35,20.85 35.35,19.85 35.35,8.15 36.5,7 42.15,7 43.7,4.5 43.7,2.68 JP3.7
D5
  Top 0.406: U1.9 43.16,22.64 47,18.8 47,14.3 47.65,13.65 47.65,6.85 46.2,5.4 46.2,2.34 JP3.6
D6
  Top 0.406: U1.10 43.72,23.23 47.75,19.2 47.75,14.55 48.45,13.85 48.45,4.23 JP3.5
D7
  Top 0.406: U1.11 44.29,23.81 48.55,19.55 48.55,14.75 49.35,13.95 49.35,5.95 51.25,4.1 51.25,3.33 JP3.4
D8
  Top 0.406: U1.12 44.85,24.35 49.3,19.9 49.3,15.15 50.1,14.35 50.1,6.9 52.65,4.35 53.5,4.35 54,3.85 54,2.44 JP3.3
D9
  Top 0.406: U1.13 45.42,24.93 50.1,20.25 50.1,15.4 50.95,14.55 50.95,7.25 53.15,5.05 55.4,5.05 56.45,4 56.45,2.35 JP3.2
D10
  Top 0.406: U1.14 45.98,25.52 50.75,20.75 50.75,15.75 51.75,14.75 51.75,7.55 53.55,5.75 56.95,5.75 59,3.7 59,2.36 JP3.1
GND  (via drill 0.3 pad 1.02, 0.3 pad 1.27, 0.6 pad 1.27, 0.6 pad 1.42)
  Top 0.152: C4.1 37.25,16.25
  Top 0.305: U$1.5 22.97,29.03 22.6,29.4 22.3,29.4 | U4.18 74.15,30 74.7,30.55 75.7,30.55 | 75.7,30.55 76.45,29.8 76.45,28.8 76.15,28.5 75.4,28.5 U4.16 | U4.21 72.65,30.8 v72.35,31.1 | v75.75,31.05 75.75,30.6 75.7,30.55 | U4.9 76.4,24.95 | 76.4,24.95 v77.33,24.02 | v77.33,24.02 78.12,23.23 | 78.12,23.23 78.9,22.45 R3.1 | U4.10 75.9,25.45 76.4,24.95 | U4.12 76.6,26.45 77,26.45 v77.3,26.75 | v77.33,24.02 78.12,23.23
  Top 0.406: 22.08,31.4 R_PULL.2 v24.6,36.2 | 22.08,31.4 22.08,31.2 | 22.08,31.2 22.08,29.62 | 22.08,29.62 22.3,29.4 | U2.2 U2.4 21.01,46.29 v20.9,46.4 20.9,44.5 v21,44.4 v21,42.5 v21,40.6 22.8,40.6 v23.2,41 v23.2,43.1 | C13.2 20.25,28.33 20.25,29.5 22.08,29.5 22.08,29.62 | 22.08,31.2 22.08,31.4 | R8.2 18.09,22.49 v16.85,21.25 | C19.2 25.95,14.51 R_T2.2 25.92,15.97 26.45,16.5 26.45,18.85 v26.15,19.15 | 37.25,16.25 37.25,22.35 | 37.25,22.35 37.25,24.59 U1.3 38.3,25.55 42.15,29.4 43.19,29.4 U1.21 44.85,31.1 47.3,33.55 47.3,35.25 48.4,36.35 | U1.5 39.32,24.42 37.25,22.35 | C5.1 41.88,15.84 v41.87,15.86 | 48.4,36.35 49.54,36.35 C1.1 | C16.2 79.6,35.6 R1.1 77.5,36 | 77.5,36 76.25,37.25 C15.2 | 48.4,36.35 49.7,36.35 v50.65,37.3 | S2.2 21.6,1.85 23.5,3.75 23.5,5.95 20.85,8.6 20.85,10.1 v21,10.25 | 51.63,33.31 C3.1 52.75,34.41 52.75,34.45 53.85,33.35 53.85,33.3 | D3.C 52.71,32.16 53.85,33.3 | v75.7,31.1 75.7,34.2 77.5,36 | C12.2 58.3,17.35 57.75,17.9 57.75,21.9 58.4,22.55 C2.2 60.4,29.2 C11.2 58.75,29.25 57.85,30.15 57.85,31.55 60.05,33.75 62.8,33.75 v64.4,35.35 67.5,35.35 C14.2 | 53.85,33.3 53.85,34.6 v53.8,34.65
  Top 0.508: v37.14,11.92 37.14,15.9 C4.1
  Top 0.61: BAT.3 13.41,18.11 C_OUT.2 12.88,18.61 CN1.GND | S2.1 S2.2 | v63.2,40.5 C6.-
  Bottom 0.305: v72.35,31.1 v75.7,31.1 v75.75,31.05 76.9,29.9 v77.3,26.75 77.3,24.05 v77.33,24.02
  Bottom 0.406: v24.6,36.2 24.6,39.6 v23.2,41 | v16.85,21.25 19.55,21.25 20,20.8 20,18.4 20,18.3 19.75,18.05 | 19.75,18.05 18.85,17.15 14.66,17.15 13.41,15.9 BAT.3 | v26.15,19.15 21.1,19.15 | 21.1,19.15 20.85,19.15 19.75,18.05 | v50.65,37.3 49.5,37.3 42.95,43.85 JP2.2 | v37.14,11.92 37.14,6.44 36.1,5.4 36.1,2.32 JP3.10 | v21,10.25 21,19.05 21.1,19.15 | v72.35,31.1 70.8,31.1 67.75,34.15 64.45,34.15 v64.4,35.35 | v63.2,40.5 59.45,40.5 53.8,34.85 v53.8,34.65 51.15,37.3 50.7,37.3
  Bottom 0.508: v41.87,15.86 41.08,15.86 v37.14,11.92
  Bottom 0.61: v64.4,35.35 64.4,39.3 v63.2,40.5
  other vias: 20.9,48.6 55.4,25.95 54.65,10 4,33.1
  pour Bottom (isolate 0.813): 0.83,49.71 0.88,0.38 10.55,0.38 10.55,12 19.45,12 19.45,0.2 81.47,0.13 81.47,26.95 81.45,26.95 81.35,0.15 66.75,0.35 67.15,29.15 80.05,29.05 80.05,28.95 81.4,28.95 81.46,49.71 19.55,49.85 19.55,40.25 19.45,40.25 19.45,40.05 10.55,40.05 10.5,49.71
  pour Top (isolate 0.61): 0.63,49.71 0.88,0.38 10.55,0.38 10.55,12.1 19.45,12.1 19.45,0.25 80.94,0.33 80.86,49.74 40.85,49.85 40.65,49.85 19.45,49.85 19.45,40.1 10.55,40.1 10.5,49.71
MISO  (via drill 0.3 pad 1.02)
  Top 0.305: U4.20 73.15,33.95 73.15,34.9 v72.35,35.7
  Top 0.406: U1.16 48,25.8 49.55,25.8 57.15,33.4 57.15,37.95 64.3,45.1 67.5,45.1 68.5,46.1 68.5,48.01 JP2.12
  Bottom 0.305: v72.35,35.7 72.35,36.3 74.35,38.3 74.35,43.65 73.2,44.8 69.8,44.8 68.5,46.1 68.5,48.01 JP2.12
MOSI
  Top 0.305: 69.33,44.52 71.53,42.33 71.4,42.2 71.4,30.6 72.15,29.85 U4.22
  Top 0.406: U1.15 46.55,26.1 47.8,24.85 49.7,24.85 58.2,33.35 58.2,37.7 64.7,44.2 69,44.2 69.33,44.52 71,46.2 71,48.05 JP2.13
N$1
  Top 0.406: U1.8 41.03,22.73 40.35,22.05 40.35,21.77 C5.2 44.47,17.65 45.4,17.65 46.3,16.75 46.3,14.25 45.74,13.69 Q2.1
N$2
  Top 0.406: U$4.O U$4.O1 7.85,45 9.1,43.75 9.1,39.4 10.4,38.9 26.2,38.9 29.85,42.3 29.95,43.17 U2.1
N$3
  Top 0.406: U1.7 40.48,23.23 39.3,22.05 39.3,21.8 40.35,20.75 40.35,19.55 39.15,18.35 C4.2
  Top 0.508: Q2.3 40.17,10.39 39.05,11.51 39.05,14.13 39.05,15.91 C4.2
N$4
  Top 0.305: U$1.9 24.47,21.53 24.45,20.45 24.45,18.51 R_T1.1
N$5
  Top 0.305: U$1.8 23.96,20.36 22.7,19.1 22.64,19.1 R7.1
N$6
  Top 0.406: U$4.P U$4.P1 7.7,41 8,40.7 8,37.2 9.7,35.5 13.78,35.5 13.9,35.62 | 15.7,28.5 15.7,30.65 U$3.3 | U$3.7 14.39,37.51 14.2,37.7 12.3,37.7 11.5,36.9 11.5,33.5 10.7,32.7 9.4,32.7 8.6,31.9 8.6,29.4 9.5,28.5 15.7,28.5 | C13.1 15.7,28.33 15.7,28.5
  Top 0.508: U$3.8 13.9,35.62 U$3.7
N$7
  Top 0.406: D3.A 50.97,30.28 R6.2
N$8  (via drill 0.6 pad 1.27)
  Top 0.406: v18.25,19.2 19.48,19.05 R7.2
  Bottom 0.406: LED3_R.1 6.85,4.4 8.35,6.25 8.35,11.4 10,13.65 10,18.15 11.05,19.2 17.2,19.2 v18.25,19.2
N$9
  Top 0.305: U$1.10 24.95,22.05 25.35,21.65 31.25,21.65
  Top 0.406: U$3.5 16.93,37.33 28.1,37.35 28.1,35.7 28.95,34.85 31.05,34.85 32.25,33.65 32.25,22.65 31.25,21.65 31.25,14.4 29.65,12.8 16.3,12.8 15.95,13.15 BAT.2 16.05,14.97 16.05,17.44
  Top 0.508: U$3.6 U$3.5
  Top 0.61: 16.05,17.44 C_OUT.1
N$10
  Top 0.406: U2.3 34.28,48.55 L2.1
N$11  (via drill 0.6 pad 1.27)
  Top 0.406: LED1_R.2 LED2_R.2 LED3_R.2 | v10.5,30.6 13.03,30.6 U$3.1 | U$3.2 14.39,32.49 14.9,33 16.3,33 16.9,32.4 16.9,30.72 U$3.4 | R_PULL.1 20.28,33.95 D1.C
  Top 0.508: U$3.1 U$3.2
  Top 0.61: U$3.4 19.39,30.69 20.5,31.8 20.4,32.91 D1.C
  Bottom 0.406: LED1_R.2 2.98,28.58 5,30.6 v10.5,30.6
N$12  (via drill 0.6 pad 1.27)
  Top 0.406: R5.2 17.14,26.34 v16.55,25.75
  Bottom 0.406: v16.55,25.75 8.6,25.75 7,24.15 7,16.2 4.3,14.2 4.3,8.64 LED2_R.1
N$13  (via drill 0.6 pad 1.27)
  Top 0.406: v16.15,23.5 16.35,23.5 17.4,24.55 18.17,24.55 R4.2
  Bottom 0.406: LED1_R.1 7.33,11.88 8.95,13.95 8.95,22.95 10.55,24.55 15.1,24.55 v16.15,23.5
N$14
  Top 0.305: U$1.4 23.46,26.31 23.2,26 20.52,26 R5.1
N$15
  Top 0.305: U$1.3 23.96,25.96 23.1,25.1 20.52,25.1 R4.1
N$16
  Top 0.406: R_T1.2 24.12,16.03 R_T2.1 18.88,14.48 BAT.1
N$17
  Top 0.305: C7.1 73.15,22.65 U4.5
N$18
  Top 0.305: U$1.6 22.95,23.44 22.95,21.6 22.9,21.6 22.1,20.7 20.45,20.7 20.05,21.1 20.05,22.35 R8.1
N$19
  Top 0.305: U$1.7 23.46,22.36 23.45,22.3 23.45,24.6 23.7,24.9 29.9,24.9 30.4,25.4 30.4,26.45 R_0.1
N$20
  Top 0.305: U4.4 72.65,22.6 C8.1
N$21
  Top 0.406: B1.P$4 73.85,19.3 C7.2
N$22
  Top 0.406: B1.P$6 71.85,19.05 C8.2
N$23
  Top 0.406: B1.P$2 L3.1 73.55,13.55 74.8,12.3 C9.2
N$24
  Top 0.406: L3.2 70.4,11.2 C10.2
  Top 1.27: L3.2 72.85,4.25 X1.1
N$25
  Top 0.406: R1.2 79.2,40 LED1.C
N$26
  Top 0.305: Y1.1 64.45,21.65 66.9,24.1 66.95,24.15 66.95,27.6 67.8,28.45 69.4,28.45 69.9,27.95 U4.26
  Top 0.406: C2.1 63.93,20.6 Y1.1
N$27
  Top 0.305: U4.25 70.25,28.45 69.5,29.2 65.73,29.2 Y1.2
  Top 0.406: C11.1 64.65,31.2 Y1.2
N$28
  Top 0.305: U4.7 74.15,23.8 74.3,23.65 76.25,23.65 77.45,20.5 79.4,20.5 R3.2
N$29
  Top 0.305: C16.1 79.45,29.4 76.3,27.45 | 76.3,27.45 U4.14 | U4.13 76.2,26.95 76.2,27.35 76.3,27.45
N$30  (via drill 0.3 pad 1.02)
  Top 0.305: U4.28 68.6,26.95 v67.85,26.2
  Top 0.406: FB1.1 69.1,31.15 v69.1,30.25 67.6,31.75 C14.1
  Bottom 0.406: v67.85,26.2 67.85,29 v69.1,30.25
N$31
  Top 0.305: U4.29 69.4,26.45 68.25,25.3 68.25,19.9 65.1,16.75 65.1,17.35 C12.1
RESET  (via drill 0.3 pad 1.27)  (1 unrouted)
  Top 0.406: v28.05,6.65 26.66,5.66 S2.3 25.8,5.83 R2.1 25.83,8 27.6,8 29.05,9.45 29.05,11.15 31.95,14.05 31.95,21.35 32.95,22.35 32.95,31.9 34.85,33.8 35.48,33.8 U1.29
  Bottom 0.406: v28.05,6.65 32.2,6.6 33.5,5.4 33.5,3.61 JP3.11
RF_VCC  (via drill 0.3 pad 1.02, 0.3 pad 1.27)  (4 unrouted)
  Top 0.305: U4.15 76.2,27.95 77.4,29.15 | v79.7,28.15 79.7,26.6
  Top 0.406: LED1.A 77.7,43.6 v77.7,44.1 76.25,42.65 | v69.9,37.55 69.9,35.25 | v69.85,37.55 69.85,40.4 C6.+
  Top 0.61: v69.85,37.55 62.65,37.55 JP1.1
  Bottom 0.305: v78,29.75 78.1,29.75 v79.7,28.15
  Bottom 0.406: v77.7,44.1 78,43.8 v78,29.75 78,31.6 76.5,33.1 70.8,33.1 69.85,34.05 v69.85,37.55 v69.9,37.55
RXI
  Top 0.406: JP3.13 29.7,4.88 29.7,10.85 32.7,13.85 32.7,21 33.6,21.9 33.6,31.6 35,33 35.2,33 38.22,29.98 U1.30
SCK  (via drill 0.3 pad 1.02)
  Top 0.305: U4.19 73.65,34 73.65,37.4 v72.6,38.45
  Top 0.406: U1.17 47.69,28.8 49.54,26.99 | 49.54,26.99 R6.1 | JP2.11 65.82,46.52 65.65,46.35 64.15,46.35 54.55,36.8 56.25,33.6 49.54,26.99
  Bottom 0.305: v72.6,38.45 72,38.45 65.65,44.8 65.65,47.98 JP2.11
SLP_TR
  Top 0.305: U4.11 76.75,25.95 78.15,24.55 79.5,24.55 R9.1
TXO
  Top 0.406: JP3.12 32.3,4.83 32.3,12.35 33.4,13.45 33.4,20.7 34.2,21.5 34.3,21.6 34.3,31.3 34.8,31.8 35.2,31.8 37.64,29.36 U1.31
VBUS
  Top 0.406: CN1.VBUS 11.79,21.86 L1.1
VCC  (via drill 0.3 pad 1.27, 0.6 pad 1.42)
  Top 0.152: U1.4 38.78,24.97 38.8,24.95
  Top 0.406: 38.8,24.95 40.3,26.45 40.65,26.45 41.27,25.82 | 41.27,25.82 41.35,25.75 41.35,25.29 U1.6 39.86,23.86 38.25,22.25 38.25,20.61 v38.68,20.18 | 41.27,25.82 42.9,27.45 44.6,27.45 46.51,29.36 U1.18 46.55,29.4 48.85,31.7 50.04,31.7 C3.2
  Top 0.508: v26.81,10.32 23.96,10.24 R2.2
  Top 0.61: L2.2 34.67,45.04 | v34.15,42.72 34.15,44.74 L2.2 | L2.2 37.53,45.26 JP2.1
  Bottom 0.406: v34.15,42.72 34.4,22.15 36.33,20.23
  Bottom 0.508: v38.68,20.18 36.33,20.23 33.06,16.76 32.78,13.36 v26.81,10.32
  Bottom 0.61: JP1.2 58.8,35.95 54.6,31.75 45.12,31.75 v34.15,42.72

### Text on the board
tNames: A3 | A2 | A1 | A7 | A0 | A6 | VCC | GND | SCK | SPK_R | MISO | MOSI | SPK_L | GND | v 1.3 | RoDuino FM | D5 | RXI | RESET | GND | D2 | D3 | D4 | D6 | D7 | D8 | D9 | TXO | D10